# EAGLE design jnode_v31 (EAGLE 6.2)
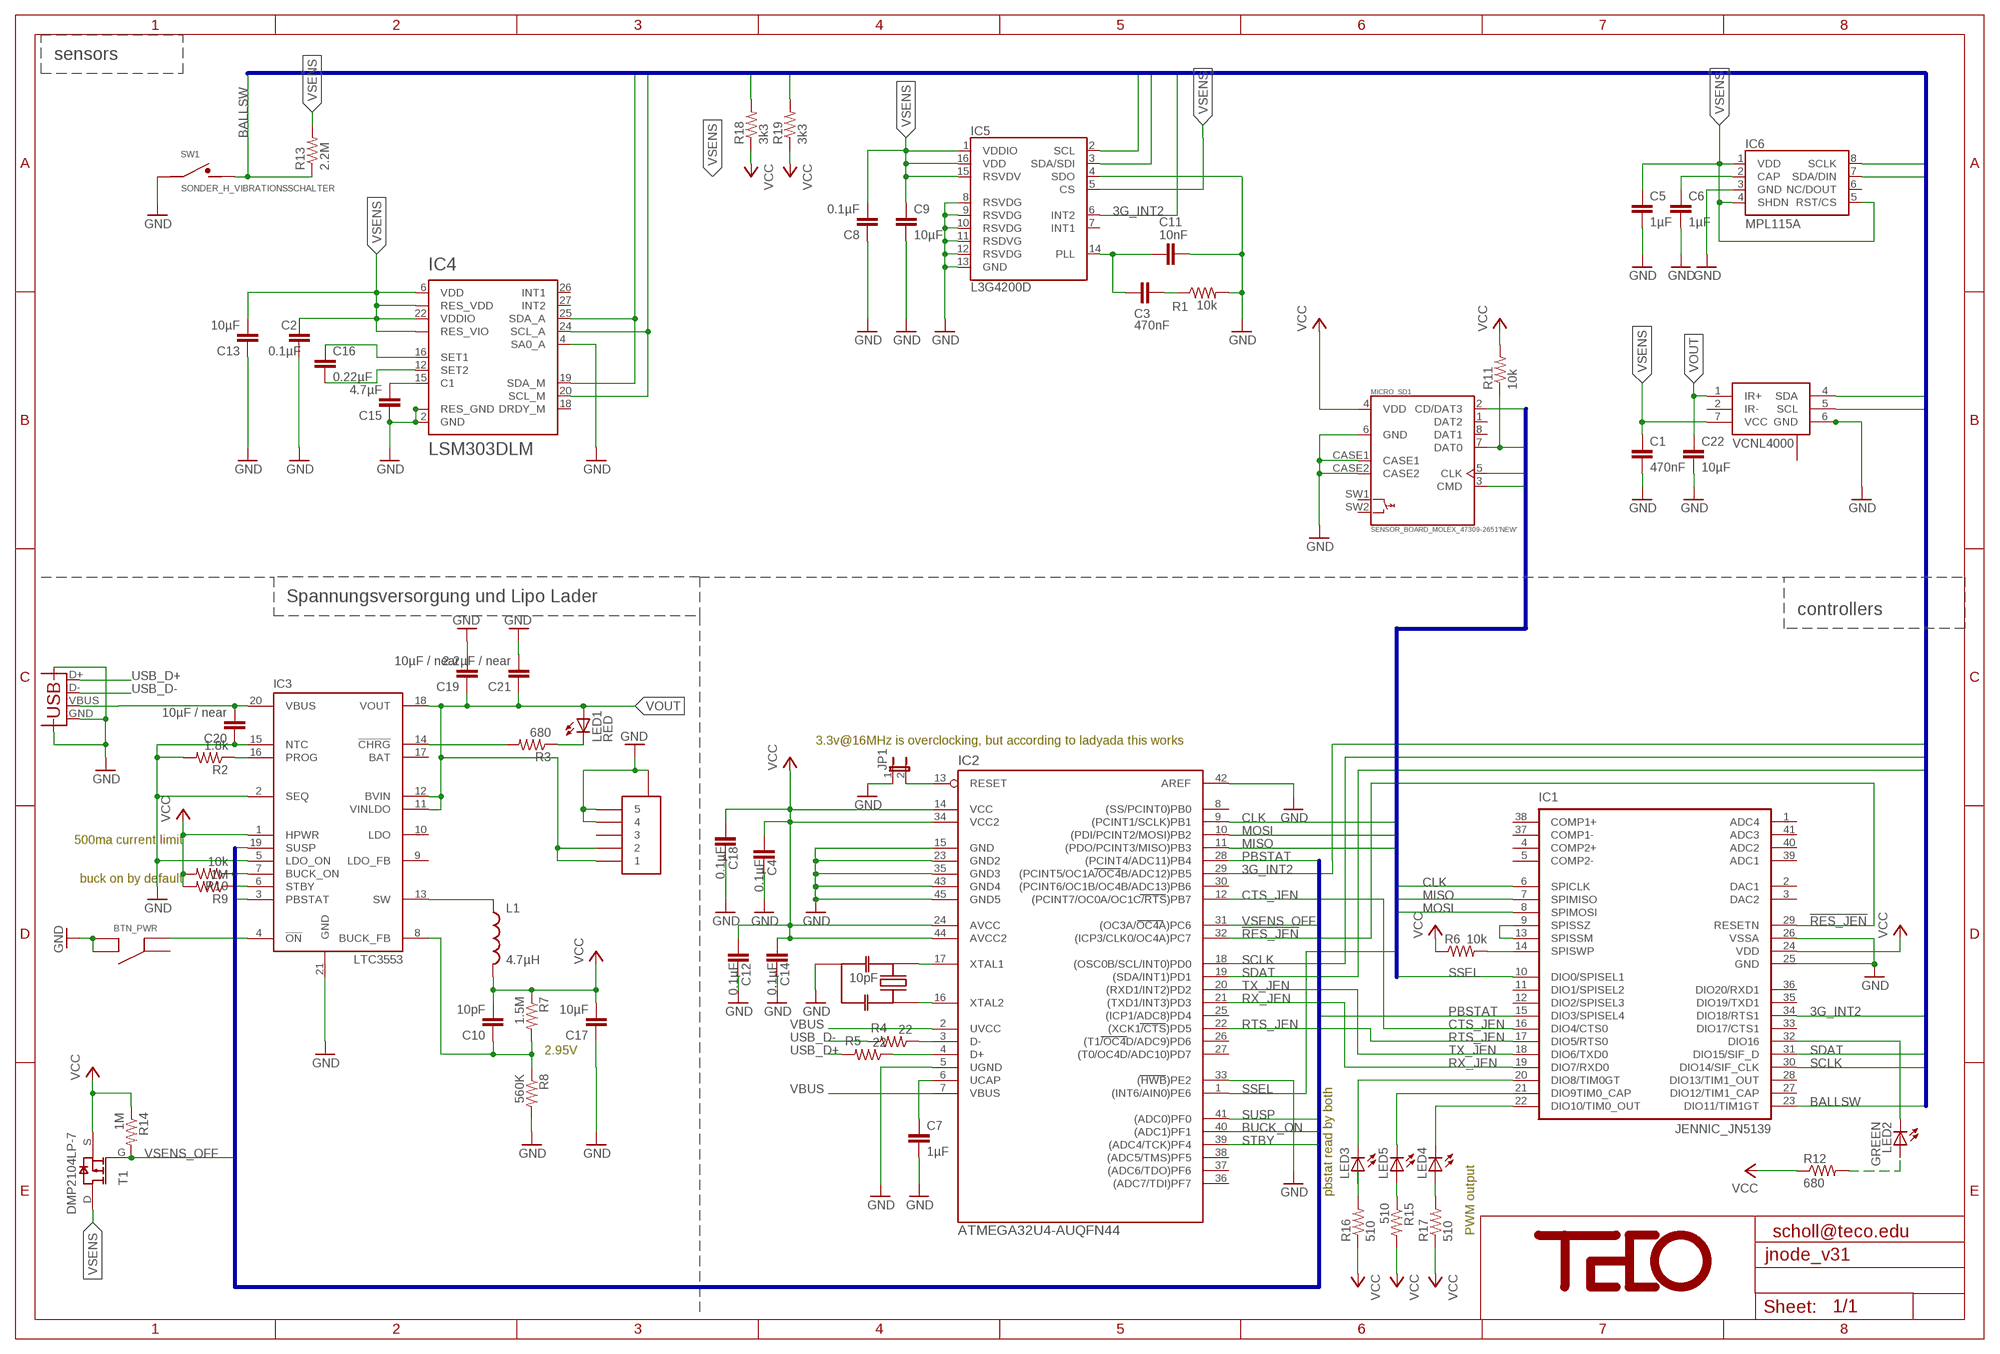
[diagram p0: schematic, sheet 1]

## Parts
BTN_PWR  TACTILE_SWITCH  [EVQ-PUK02K]
C1  470nF  CAP0402-CAP  [0402-CAP]
C2  0.1µF  CAP0402-CAP  [0402-CAP]
C3  470nF  CAP0402-CAP  [0402-CAP]
C4  0.1µF  CAP0402-CAP  [0402-CAP]
C5  1µF  CAP0402-CAP  [0402-CAP]
C6  1µF  CAP0402-CAP  [0402-CAP]
C7  1µF  CAP0402-CAP  [0402-CAP]
C8  0.1µF  CAP0402-CAP  [0402-CAP]
C9  10µF  CAP0603-CAP  [0603-CAP]
C10  10pF  CAP0402-CAP  [0402-CAP]
C11  10nF  CAP0402-CAP  [0402-CAP]
C12  0.1µF  CAP0402-CAP  [0402-CAP]
C13  10µF  CAP0603-CAP  [0603-CAP]
C14  0.1µF  CAP0402-CAP  [0402-CAP]
C15  4.7µF  CAP0402-CAP  [0402-CAP]
C16  0.22µF  CAP0402-CAP  [0402-CAP]
C17  10µF  CAP0603-CAP  [0603-CAP]
C18  0.1µF  CAP0402-CAP  [0402-CAP]
C19  10µF / near  CAP0603-CAP  [0603-CAP]
C20  10µF / near  CAP0603-CAP  [0603-CAP]
C21  2.2µF / near  CAP0402-CAP  [0402-CAP]
C22  10µF  CAP0603-CAP  [0603-CAP]
IC1  JENNIC_JN5139  JENNIC_JN51XXSMDTH  [JN5148_SMDTH]
IC2  ATMEGA32U4-AUQFN44  [QFN44]
IC3  LTC3553  [QFN20]
IC4  LSM303DLM  LSM303LGA28_LONG  [LGA28]
IC5  L3G4200D  [LGA16-4X4]
IC6  MPL115A  [LGA8]
JP1  JUMPER-2SMD-NO  [SJ_2S-NO]
L1  4.7µH  SPARKFUN_INDUCTOR  [MLP2012]
LED1  RED  LEDCHIP-LED0402  [CHIP-LED0402]
LED2  GREEN  LEDCHIP-LED0402  [CHIP-LED0402]
LED3  LEDGL100MD1MP1  [GL100MD1MP1]
LED4  LEDGL100MD1MP1  [GL100MD1MP1]
LED5  LEDGL100MD1MP1  [GL100MD1MP1]
MICRO_SD1  SENSOR_BOARD_MOLEX_47309-2651'NEW'  [SENSOR_BOARD_MOLEX_47309-2651]
R1  10k  RESISTOR0402-RES  [0402-RES]
R2  1.8k  RESISTOR0402-RES  [0402-RES]
R3  680  RESISTOR0402-RES  [0402-RES]
R4  22  RESISTOR0402-RES  [0402-RES]
R5  22  RESISTOR0402-RES  [0402-RES]
R6  10k  RESISTOR0402-RES  [0402-RES]
R7  1.5M  RESISTOR0402-RES  [0402-RES]
R8  560K  RESISTOR0402-RES  [0402-RES]
R9  1M  RESISTOR0402-RES  [0402-RES]
R10  10k  RESISTOR0402-RES  [0402-RES]
R11  10k  RESISTOR0402-RES  [0402-RES]
R12  680  RESISTOR0402-RES  [0402-RES]
R13  2.2M  RESISTOR  [0805]
R14  1M  RESISTOR0402-RES  [0402-RES]
R15  510  RESISTOR0402-RES  [0402-RES]
R16  510  RESISTOR0402-RES  [0402-RES]
R17  510  RESISTOR0402-RES  [0402-RES]
R18  3k3  RESISTOR0402-RES  [0402-RES]
R19  3k3  RESISTOR0402-RES  [0402-RES]
SW1  SONDER_H_VIBRATIONSSCHALTER  [SONDER_H_VIBSCHALTER]
T1  DMP2104LP-7  [DFN1411-3]
U$1  SFV5R  [SFV5R]
U$6  RESONATORPRQC-S  [PRQC]
U$9  TECO-LOGO  [TECO-LOGO]
VCNL4000  VCNL4000  [VNCL4000]
X1  USB-MICROB  [USB-MICROB]

## Nets
3G_INT2: IC1.34(DIO18/RTS1) IC2.29((PCINT5/OC1A/OC4B/ADC12)PB5) IC5.6(INT2)
!RES_JEN: IC1.29(RESETN) IC2.32((ICP3/CLK0/OC4A)PC7)
BALLSW: IC1.23(DIO11/TIM1GT) R13.1 SW1.2
BUCK_FB: C10.1 IC3.8(BUCK_FB) R7.2 R8.1
BUCK_ON: IC2.40((ADC1)PF1) IC3.7(BUCK_ON) R10.1
CLK: IC1.6(SPICLK) IC2.9((PCINT1/SCLK)PB1) MICRO_SD1.5(CLK)
CTS_JEN: IC1.16(DIO4/CTS0) IC2.12((PCINT7/OC0A/OC1C/RTS)PB7)
GND: BTN_PWR.2(B) BTN_PWR.4(B) C1.2 C2.2 C4.1 C5.2 C6.2 C7.2 C8.1 C9.2 C11.1 C12.1 C13.1 C14.1 C15.1 C17.1 C18.1 C19.2 C20.1 C21.2 C22.2 IC1.25(GND) IC1.26(VSSA) IC2.5(UGND) IC2.15(GND) IC2.23(GND2) IC2.33((HWB)PE2) IC2.35(GND3) IC2.42(AREF) IC2.43(GND4) IC2.45(GND5) IC3.2(SEQ) IC3.5(LDO_ON) IC3.15(NTC) IC3.21(GND) IC4.1(RES_GND) IC4.2(GND) IC4.3(RES_GND) IC4.4(SA0_A) IC4.17(RES_GND) IC4.28(RES_GND) IC5.4(SDO) IC5.8(RSVDG) IC5.9(RSVDG) IC5.10(RSVDG) IC5.11(RSDVG) IC5.12(RSVDG) IC5.13(GND) IC6.3(GND) JP1.1 MICRO_SD1.6(GND) MICRO_SD1.CASE1 MICRO_SD1.CASE2 R1.2 R2.2 R8.2 SW1.1 U$1.P$4 U$1.P$5 U$1.P$6 U$1.P$7 U$6.GND VCNL4000.6(GND) VCNL4000.12(GND) X1.GND X1.GND@2(CASE) X1.GND@3(CASE)
LEDRED: IC1.32(DIO16) LED2.P$2(C)
MISO: IC1.7(SPIMISO) IC2.11((PDO/PCINT3/MISO)PB3) MICRO_SD1.7(DAT0) R11.1
MOSI: IC1.8(SPIMOSI) IC2.10((PDI/PCINT2/MOSI)PB2) MICRO_SD1.3(CMD)
N$1: IC2.3(D-) R4.1
N$2: C16.1 IC4.16(SET1)
N$3: IC2.4(D+) R5.1
N$4: C7.1 IC2.6(UCAP)
N$5: IC3.16(PROG) R2.1
N$6: VCNL4000.2(IR-) VCNL4000.3(IR-)
N$8: C16.2 IC4.12(SET2)
N$9: BTN_PWR.3(A) IC3.4(!ON)
N$10: C6.1 IC6.2(CAP)
N$11: LED1.P$2(C) R3.1
N$12: IC3.14(!CHRG) R3.2
N$13: IC1.9(SPISSZ) IC1.13(SPISSM)
N$14: IC1.14(SPISWP) R6.2
N$16: IC2.17(XTAL1) U$6.2
N$17: IC2.16(XTAL2) U$6.1
N$25: C15.2 IC4.15(C1)
N$26: C3.1 C11.2 IC5.14(PLL)
N$27: C3.2 R1.1
N$29: LED2.P$1(A) R12.2
N$30: IC1.21(DIO9TIM0_CAP) LED5.2(C)
N$31: IC1.20(DIO8/TIM0GT) LED3.2(C)
N$32: LED3.1(A) R16.2
N$33: LED5.1(A) R15.1
N$34: IC1.22(DIO10/TIM0_OUT) LED4.2(C)
N$35: LED4.1(A) R17.2
PBSTAT: IC1.15(DIO3/SPISEL4) IC2.28((PCINT4/ADC11)PB4) IC3.3(PBSTAT)
RTS_JEN: IC1.17(DIO5/RTS0) IC2.22((XCK1/CTS)PD5)
RX_JEN: IC1.19(DIO7/RXD0) IC2.21((TXD1/INT3)PD3)
SCLK: IC1.30(DIO14/SIF_CLK) IC2.18((OSC0B/SCL/INT0)PD0) IC4.20(SCL_M) IC4.24(SCL_A) IC5.2(SCL) IC6.8(SCLK) R19.2 VCNL4000.5(SCL)
SDAT: IC1.31(DIO15/SIF_D) IC2.19((SDA/INT1)PD1) IC4.19(SDA_M) IC4.25(SDA_A) IC5.3(SDA/SDI) IC6.7(SDA/DIN) R18.2 VCNL4000.4(SDA)
SHWO: IC2.13(RESET) JP1.2
SSEL: IC1.10(DIO0/SPISEL1) IC2.1((INT6/AIN0)PE6) MICRO_SD1.2(CD/DAT3)
STBY: IC2.39((ADC4/TCK)PF4) IC3.6(STBY) R9.1
SUSP: IC2.41((ADC0)PF0) IC3.19(SUSP)
SW: IC3.13(SW) L1.P$1
TX_JEN: IC1.18(DIO6/TXD0) IC2.20((RXD1/INT2)PD2)
USB_D+: R5.2 X1.D+
USB_D-: R4.2 X1.D-
VBUS: C20.2 IC2.2(UVCC) IC2.7(VBUS) IC3.20(VBUS) X1.VBUS
VCC: C4.2 C10.2 C12.2 C14.2 C17.2 C18.2 IC1.24(VDD) IC2.14(VCC) IC2.24(AVCC) IC2.34(VCC2) IC2.44(AVCC2) IC3.1(HPWR) L1.P$2 MICRO_SD1.4(VDD) R6.1 R7.1 R9.2 R10.2 R11.2 R12.1 R14.1 R15.2 R16.1 R17.1 R18.1 R19.1 T1.S
VOUT: C19.1 C21.1 C22.1 IC3.11(VINLDO) IC3.12(BVIN) IC3.18(VOUT) LED1.P$1(A) U$1.P$1 U$1.P$2 VCNL4000.1(IR+)
VSENS: C1.1 C2.1 C5.1 C8.2 C9.1 C13.2 IC4.6(VDD) IC4.7(RES_VDD) IC4.22(VDDIO) IC4.23(RES_VIO) IC5.1(VDDIO) IC5.5(CS) IC5.15(RSVDV) IC5.16(VDD) IC6.1(VDD) IC6.4(SHDN) IC6.5(RST/CS) R13.2 T1.D VCNL4000.7(VCC)
VSENS_OFF: IC2.31((OC3A/OC4A)PC6) R14.2 T1.G
Unconnected: BTN_PWR.1(A) IC1.1(ADC4) IC1.2(DAC1) IC1.3(DAC2) IC1.4(COMP2+) IC1.5(COMP2-) IC1.11(DIO1/SPISEL2) IC1.12(DIO2/SPISEL3) IC1.27(DIO12/TIM1_CAP) IC1.28(DIO13/TIM1_OUT) IC1.33(DIO17/CTS1) IC1.35(DIO19/TXD1) IC1.36(DIO20/RXD1) IC1.37(COMP1-) IC1.38(COMP1+) IC1.39(ADC1) IC1.40(ADC2) IC1.41(ADC3) IC2.8((SS/PCINT0)PB0) IC2.25((ICP1/ADC8)PD4) IC2.26((T1/OC4D/ADC9)PD6) IC2.27((T0/OC4D/ADC10)PD7) IC2.30((PCINT6/OC1B/OC4B/ADC13)PB6) IC2.36((ADC7/TDI)PF7) IC2.37((ADC6/TDO)PF6) IC2.38((ADC5/TMS)PF5) IC3.9(LDO_FB) IC3.10(LDO) IC3.17(BAT) IC4.18(DRDY_M) IC4.26(INT1) IC4.27(INT2) IC5.7(INT1) IC6.6(NC/DOUT) MICRO_SD1.1(DAT2) MICRO_SD1.8(DAT1) MICRO_SD1.SW1 MICRO_SD1.SW2 U$1.P$3 VCNL4000.8(NC) VCNL4000.9(NC) VCNL4000.10(NC) VCNL4000.11(NC)

## Buses
PWRCTRL:BUCK_ON,STBY,PBSTAT,SUSP,VSENS_OFF
SPI:SSEL,MISO,MOSI,CLK
I2C:SCLK,SDAT,BALLSW,INT1

## Notes on the sheet
- sensors
- Spannungsversorgung und Lipo Lader
- controllers
- 3.3v@16MHz is overclocking, but according to ladyada this works
- 500ma current limit
- buck on by default
- 10pF
- 2.95V
- pbstat read by both
- PWM output | scholl@teco.edu

## Library data of the parts
BTN_PWR = jnode:TACTILE_SWITCH: collection of tactile switches; DIGIKEY: http://search.digikey.com/scripts/DkSearch/dksus.dll?Detail&name=P10852SCT-ND
C1 C3 = sparkfun:CAP: Capacitor Standard 0603 ceramic capacitor, and 0.1" leaded capacitor.; DIGIKEY: http://search.digikey.com/scripts/DkSearch/dksus.dll?Detail&name=311-1334-1-ND; FARNELL: http://de.farnell.com/multicomp/mcca000510/mlcc-0402-x5r-16v-0-047uf/dp/1759386; TECO: yes
C2 = sparkfun:CAP: Capacitor Standard 0603 ceramic capacitor, and 0.1" leaded capacitor.; DIGIKEY: http://search.digikey.com/scripts/DkSearch/dksus.dll?Detail&name=445-7396-1-ND; FARNELL: http://de.farnell.com/multicomp/mcca000051/mlcc-04025v-16v-100nf/dp/1758897; TECO: yes
C4 C18 = sparkfun:CAP: Capacitor Standard 0603 ceramic capacitor, and 0.1" leaded capacitor.; DIGIKEY: http://search.digikey.com/scripts/DkSearch/dksus.dll?Detail&name=490-1318-1-ND; FARNELL: http://de.farnell.com/multicomp/mcca000051/mlcc-04025v-16v-100nf/dp/1758897; PLACE: no; TECO: yes
C5-C7 = sparkfun:CAP: Capacitor Standard 0603 ceramic capacitor, and 0.1" leaded capacitor.; DIGIKEY: http://search.digikey.com/scripts/DkSearch/dksus.dll?Detail&name=490-1320-1-ND; FARNELL: http://de.farnell.com/multicomp/mcca000500/mlcc-0402-x5r-6-3v-1uf/dp/1759375; TECO: yes
C8 C12 C14 = sparkfun:CAP: Capacitor Standard 0603 ceramic capacitor, and 0.1" leaded capacitor.; DIGIKEY: http://search.digikey.com/scripts/DkSearch/dksus.dll?Detail&name=490-1318-1-ND; FARNELL: http://de.farnell.com/multicomp/mcca000051/mlcc-04025v-16v-100nf/dp/1758897; TECO: yes
C9 C19 C20 = sparkfun:CAP: Capacitor Standard 0603 ceramic capacitor, and 0.1" leaded capacitor.; DIGIKEY: http://search.digikey.com/scripts/DkSearch/dksus.dll?Detail&name=445-7454-1-ND; FARNELL: http://de.farnell.com/multicomp/mcca000517/mlcc-0603-x5r-6-3v-10uf/dp/1759393; TECO: yes
C10 = sparkfun:CAP: Capacitor Standard 0603 ceramic capacitor, and 0.1" leaded capacitor.; DIGIKEY: http://search.digikey.com/scripts/DkSearch/dksus.dll?Detail&name=311-1014-1-ND; FARNELL: http://de.farnell.com/multicomp/mcca000091/mlcc-0402-np0-50v-10pf/dp/1758941; TECO: yes
C11 = sparkfun:CAP: Capacitor Standard 0603 ceramic capacitor, and 0.1" leaded capacitor.; DIGIKEY: http://search.digikey.com/scripts/DkSearch/dksus.dll?Detail&name=478-1114-1-ND; FARNELL: http://de.farnell.com/multicomp/mcca000076/mlcc-0402-x7r-25v-10nf/dp/1758924; TECO: yes
C13 = sparkfun:CAP: Capacitor Standard 0603 ceramic capacitor, and 0.1" leaded capacitor.; FARNELL: http://de.farnell.com/multicomp/mcca000517/mlcc-0603-x5r-6-3v-10uf/dp/1759393; TECO: yes
C15 = sparkfun:CAP: Capacitor Standard 0603 ceramic capacitor, and 0.1" leaded capacitor.; DIGIKEY: http://search.digikey.com/scripts/DkSearch/dksus.dll?Detail&name=490-5408-1-ND; FARNELL: http://de.farnell.com/avx/04024d475mat2a/kondensator-0402-x5r-4v-4-7uf/dp/1833801; TECO: yes
C16 = sparkfun:CAP: Capacitor Standard 0603 ceramic capacitor, and 0.1" leaded capacitor.; DIGIKEY: http://search.digikey.com/scripts/DkSearch/dksus.dll?Detail&name=311-1350-1-ND; FARNELL: http://de.farnell.com/multicomp/mcca000036/mlcc-04025v-10v-220nf/dp/1758880; TECO: yes
C17 C22 = sparkfun:CAP: Capacitor Standard 0603 ceramic capacitor, and 0.1" leaded capacitor.; DIGIKEY: http://search.digikey.com/scripts/DkSearch/dksus.dll?Detail&name=311-1014-1-ND; FARNELL: http://de.farnell.com/multicomp/mcca000517/mlcc-0603-x5r-6-3v-10uf/dp/1759393; TECO: yes
C21 = sparkfun:CAP: Capacitor Standard 0603 ceramic capacitor, and 0.1" leaded capacitor.; DIGIKEY: http://search.digikey.com/scripts/DkSearch/dksus.dll?Detail&name=445-7396-1-ND; FARNELL: http://de.farnell.com/multicomp/mcca000501/mlcc-0402-x5r-6-3v-2-2uf/dp/1759376RL; TECO: yes
IC1 = jnode:JENNIC_JN51XX: JN5139-xxx-M00xxx, Farnell: 1500175; DIGIKEY: http://search.digikey.com/de/de/products/JN5148%2F001M00T,534/616-1045-1-ND/2139684; FUTUREELECTRIC: http://de.futureelectronics.com/de/technologies/semiconductors/microcontrollers/32-bit/Seiten/6004977-JN5148-001M00T,534.aspx; TECO: yes
IC2 = jnode:ATMEGA32U4-AU; DIGIKEY: http://search.digikey.com/scripts/DkSearch/dksus.dll?Detail&name=ATMEGA32U4-MU-ND
IC3 = jnode:LTC3553; DIGIKEY: http://search.digikey.com/scripts/DkSearch/dksus.dll?Detail&name=LTC3553EUD%23PBF-ND
IC4 = jnode:LSM303: LSM303DLH ? 3-axis accelerometer and 3-axis magnetometer ? Digital supply voltage IOs: 1.8 V ? Power-down mode ? ±1.3 to ±8,1 gauss magnetic field full-scale ? ±2 g/±4 g/±8 g dynamically selectable fullscale ? 16-bit data out ? I2C serial interface http://www.st.com/stonline/products/literature/ds/16941/lsm303dlh.pdf; DIGIKEY: http://search.digikey.com/scripts/DkSearch/dksus.dll?Detail&name=497-11240-1-ND; FUTUREELECTRIC: http://de.futureelectronics.com/de/technologies/semiconductors/analog/sensors/accelerometers/Seiten/8010012-LSM303DLMTR.aspx
IC5 = sparkfun:L3G4200D: L3G4200D Three-axis, digital output gyroscope The L3G4200D is a low-power three-axis angular rate sensor, has a full scale of ±250/±500/±2000 dps and is capable of measuring rates with a user-selectable bandwidth. It includes a sensing element and an IC interface capable of providing the measured angular rate to the external world through a digital interface (I2C/SPI). Package: 4x4x1.1 LGA-16 (LGA16-4x4.PAC); DIGIKEY: http://search.digikey.com/scripts/DkSearch/dksus.dll?Detail&name=497-11071-1-ND; FARNELL: http://de.farnell.com/stmicroelectronics/l3g4200d/gyro-mems-3achsen-16llga-16lga/dp/1872924?Ntt=l3g4200; FUTUREELECTRIC: http://de.futureelectronics.com/de/technologies/semiconductors/analog/sensors/motion/Seiten/2007852-L3G4200DTR.aspx
IC6 = mpl115:MPL115A: MPL115A1 (SPI) and MPL115A2 (I2C) Miniature Digital Barometer 5.0x3.0x1.2mm LGA Package; DIGIKEY: http://search.digikey.com/scripts/DkSearch/dksus.dll?Detail&name=MPL115A2T1CT-ND; TECO: yes
JP1 = sparkfun:JUMPER-2: Jumper Basic 0.1" spaced jumper. Use with breakaway headers.
L1 = jnode:SPARKFUN_INDUCTOR: Inductors Basic Inductor/Choke - 0603 and 1206. Footprints are not proven and vary greatly between part numbers.; DIGIKEY: http://search.digikey.com/scripts/DkSearch/dksus.dll?Detail&name=445-6366-1-ND
LED1 LED2 = jnode:LED: LED OSRAM: - CHIPLED LG R971, LG N971, LY N971, LG Q971, LY Q971, LO R971, LY R971 LH N974, LH R974 LS Q976, LO Q976, LY Q976 LO Q996 - Hyper CHIPLED LW Q18S LB Q993, LB Q99A, LB R99A - SideLED LS A670, LO A670, LY A670, LG A670, LP A670 LB A673, LV A673, LT A673, LW A673 LH A674 LY A675 LS A676, LA A676, LO A676, LY A676, LW A676 LS A679, LY A679, LG A679 - Hyper Micro SIDELED® LS Y876, LA Y876, LO Y876, LY Y876 LT Y87S - SmartLED LW L88C, LW L88S LB L89C, LB L89S, LG L890 LS L89K, LO L89K, LY L89K LS L896, LA L896, LO L896, LY L896 - TOPLED LS T670, LO T670, LY T670, LG T670, LP T670 LSG T670, LSP T670, LSY T670, LOP T670, LYG T670 LG T671, LOG T671, LSG T671 LB T673, LV T673, LT T673, LW T673 LH T674 LS T676, LA T676, LO T676, LY T676, LB T676, LH T676, LSB T676, LW T676 LB T67C, LV T67C, LT T67C, LS T67K, LO T67K, LY T67K, LW E67C LS E67B, LA E67B, LO E67B, LY E67B, LB E67C, LV E67C, LT E67C LW T67C LS T679, LY T679, LG T679 LS T770, LO T770, LY T770, LG T770, LP T770 LB T773, LV T773, LT T773, LW T773 LH T774 LS E675, LA E675, LY E675, LS T675 LS T776, LA T776, LO T776, LY T776, LB T776 LHGB T686 LT T68C, LB T68C - Hyper Mini TOPLED® LB M676 - Mini TOPLED Santana® LG M470 LS M47K, LO M47K, LY M47K Source: http://www.osram.convergy.de LUXEON: - LUMILED® LXK2-PW12-R00, LXK2-PW12-S00, LXK2-PW14-U00, LXK2-PW14-V00 LXK2-PM12-R00, LXK2-PM12-S00, LXK2-PM14-U00 LXK2-PE12-Q00, LXK2-PE12-R00, LXK2-PE12-S00, LXK2-PE14-T00, LXK2-PE14-U00 LXK2-PB12-K00, LXK2-PB12-L00, LXK2-PB12-M00, LXK2-PB14-N00, LXK2-PB14-P00, LXK2-PB14-Q00 LXK2-PR12-L00, LXK2-PR12-M00, LXK2-PR14-Q00, LXK2-PR14-R00 LXK2-PD12-Q00, LXK2-PD12-R00, LXK2-PD12-S00 LXK2-PH12-R00, LXK2-PH12-S00 LXK2-PL12-P00, LXK2-PL12-Q00, LXK2-PL12-R00 Source: www.luxeon.com KINGBRIGHT: KA-3528ASYC Source: www.kingbright.com; DIGIKEY: http://search.digikey.com/scripts/DkSearch/dksus.dll?Detail&name=754-1128-1-ND; TECO: yes
LED3-LED5 = jnode:LED: LED OSRAM: - CHIPLED LG R971, LG N971, LY N971, LG Q971, LY Q971, LO R971, LY R971 LH N974, LH R974 LS Q976, LO Q976, LY Q976 LO Q996 - Hyper CHIPLED LW Q18S LB Q993, LB Q99A, LB R99A - SideLED LS A670, LO A670, LY A670, LG A670, LP A670 LB A673, LV A673, LT A673, LW A673 LH A674 LY A675 LS A676, LA A676, LO A676, LY A676, LW A676 LS A679, LY A679, LG A679 - Hyper Micro SIDELED® LS Y876, LA Y876, LO Y876, LY Y876 LT Y87S - SmartLED LW L88C, LW L88S LB L89C, LB L89S, LG L890 LS L89K, LO L89K, LY L89K LS L896, LA L896, LO L896, LY L896 - TOPLED LS T670, LO T670, LY T670, LG T670, LP T670 LSG T670, LSP T670, LSY T670, LOP T670, LYG T670 LG T671, LOG T671, LSG T671 LB T673, LV T673, LT T673, LW T673 LH T674 LS T676, LA T676, LO T676, LY T676, LB T676, LH T676, LSB T676, LW T676 LB T67C, LV T67C, LT T67C, LS T67K, LO T67K, LY T67K, LW E67C LS E67B, LA E67B, LO E67B, LY E67B, LB E67C, LV E67C, LT E67C LW T67C LS T679, LY T679, LG T679 LS T770, LO T770, LY T770, LG T770, LP T770 LB T773, LV T773, LT T773, LW T773 LH T774 LS E675, LA E675, LY E675, LS T675 LS T776, LA T776, LO T776, LY T776, LB T776 LHGB T686 LT T68C, LB T68C - Hyper Mini TOPLED® LB M676 - Mini TOPLED Santana® LG M470 LS M47K, LO M47K, LY M47K Source: http://www.osram.convergy.de LUXEON: - LUMILED® LXK2-PW12-R00, LXK2-PW12-S00, LXK2-PW14-U00, LXK2-PW14-V00 LXK2-PM12-R00, LXK2-PM12-S00, LXK2-PM14-U00 LXK2-PE12-Q00, LXK2-PE12-R00, LXK2-PE12-S00, LXK2-PE14-T00, LXK2-PE14-U00 LXK2-PB12-K00, LXK2-PB12-L00, LXK2-PB12-M00, LXK2-PB14-N00, LXK2-PB14-P00, LXK2-PB14-Q00 LXK2-PR12-L00, LXK2-PR12-M00, LXK2-PR14-Q00, LXK2-PR14-R00 LXK2-PD12-Q00, LXK2-PD12-R00, LXK2-PD12-S00 LXK2-PH12-R00, LXK2-PH12-S00 LXK2-PL12-P00, LXK2-PL12-Q00, LXK2-PL12-R00 Source: www.luxeon.com KINGBRIGHT: KA-3528ASYC Source: www.kingbright.com; FARNELL: http://de.farnell.com/sharp/gl100md1mp1/ir-emitter-smd-940nm/dp/9707816?Ntt=970-7816; PLACE: no
MICRO_SD1 = teco_div:SENSOR_BOARD_MOLEX_47309-2651; DIGIKEY: http://search.digikey.com/scripts/DkSearch/dksus.dll?Detail&name=WM3974CT-ND; TECO: yes
R1 R6 R9-R11 R14 = sparkfun:RESISTOR: Resistor Basic schematic elements and footprints for 0603, 1206, and PTH 1/10th watt (small) resistors.; DIGIKEY: http://search.digikey.com/scripts/DkSearch/dksus.dll?Detail&name=311-10KJRCT-ND; FARNELL: http://de.farnell.com/bourns/cr0603-jw-103elf/widerstand-0603-10k-5-0-1w/dp/2008360; TECO: yes
R2 = sparkfun:RESISTOR: Resistor Basic schematic elements and footprints for 0603, 1206, and PTH 1/10th watt (small) resistors.; DIGIKEY: http://search.digikey.com/scripts/DkSearch/dksus.dll?Detail&name=311-1.8KJRCT-ND; FARNELL: http://de.farnell.com/vishay-draloric/crcw04021k80fkeahp/widerstand-0402-1-1k80/dp/1738853; TECO: yes
R3 = sparkfun:RESISTOR: Resistor Basic schematic elements and footprints for 0603, 1206, and PTH 1/10th watt (small) resistors.; DIGIKEY: http://search.digikey.com/scripts/DkSearch/dksus.dll?Detail&name=311-39JRCT-ND
R4 R5 = sparkfun:RESISTOR: Resistor Basic schematic elements and footprints for 0603, 1206, and PTH 1/10th watt (small) resistors.; DIGIKEY: http://search.digikey.com/scripts/DkSearch/dksus.dll?Detail&name=311-22JRCT-ND; FARNELL: http://de.farnell.com/multicomp/mc-0-0625w-0402-1-22r/widerstand-0402-1-22r/dp/1357998
R7 = sparkfun:RESISTOR: Resistor Basic schematic elements and footprints for 0603, 1206, and PTH 1/10th watt (small) resistors.; DIGIKEY: http://search.digikey.com/scripts/DkSearch/dksus.dll?Detail&name=541-2.20MLCT-ND; FARNELL: http://de.farnell.com/yageo-phycomp/rc0402fr-071m8l/widerstand-0402-0-063w-1-1m8/dp/1458753; TECO: yes
R8 = sparkfun:RESISTOR: Resistor Basic schematic elements and footprints for 0603, 1206, and PTH 1/10th watt (small) resistors.; DIGIKEY: http://search.digikey.com/scripts/DkSearch/dksus.dll?Detail&name=RMCF0402FT698KCT-ND; FARNELL: http://de.farnell.com/yageo-phycomp/rc0402jr-07560kl/widerstand-rc31-0402-560k/dp/9233091
R12 = sparkfun:RESISTOR: Resistor Basic schematic elements and footprints for 0603, 1206, and PTH 1/10th watt (small) resistors.
R13 = sparkfun:RESISTOR: Resistor Basic schematic elements and footprints for 0603, 1206, and PTH 1/10th watt (small) resistors.; DIGIKEY: http://search.digikey.com/scripts/DkSearch/dksus.dll?Detail&name=541-2.20MLCT-ND; FARNELL: http://de.farnell.com/te-connectivity-cgs/rh73u2a2m2jtd/widerstand-0805-2m2/dp/1174056
R15-R17 = sparkfun:RESISTOR: Resistor Basic schematic elements and footprints for 0603, 1206, and PTH 1/10th watt (small) resistors.; PLACE: no
R18 R19 = sparkfun:RESISTOR: Resistor Basic schematic elements and footprints for 0603, 1206, and PTH 1/10th watt (small) resistors.; DIGIKEY: http://search.digikey.com/scripts/DkSearch/dksus.dll?Detail&name=541-2.20MLCT-ND; FARNELL: http://de.farnell.com/bourns/cr0603-jw-103elf/widerstand-0603-10k-5-0-1w/dp/2008360; PLACE: no; TECO: yes
SW1 = jnode:SONDER_H_VIBRATIONSSCHALTER: Vibrationsschalter von FZK oder Signalquest SignalQuest, Inc. 1 Mechanic St. Lebanon, NH 03766 USA www.signalquest.com
T1 = jnode:DMP2104LP
U$1 = jnode:SFV5R; DIGIKEY: http://www.digikey.de/product-detail/de/SFV5R-1STE1HLF/609-4330-1-ND/2626781; KONTAKTE: unten
U$6 = jnode:RESONATOR: Ceramic Resonator with caps AWSCR-16.00CV-T: 16Mhz ceramic resonator with 22pF capacitors PRQC16.00SR5010X000: 16Mhz ceramic resonator with 10pF capacitors; DIGIKEY: http://search.digikey.com/scripts/DkSearch/dksus.dll?Detail&name=478-5420-1-ND
U$9 = teco_div:TECO-LOGO
VCNL4000 = VCNL4000:VCNL4000; DIGIKEY: http://search.digikey.com/scripts/DkSearch/dksus.dll?Detail&name=751-1505-1-ND; TECO: yes
X1 = sparkfun:USB: USB Connectors USB-B-PTH is fully proven SKU : PRT-00139 USB-miniB is fully proven SKU : PRT-00587 USB-A-PCB is untested. USB-A-H is throughly reviewed, but untested. Spark Fun Electronics SKU : PRT-00437 USB-B-SMT is throughly reviewed, but untested. Needs silkscreen touching up. USB-A-S has not been used/tested USB-MB-H has not been used/tested; DIGIKEY: http://search.digikey.com/scripts/DkSearch/dksus.dll?Detail&name=H11635CT-ND

## Board
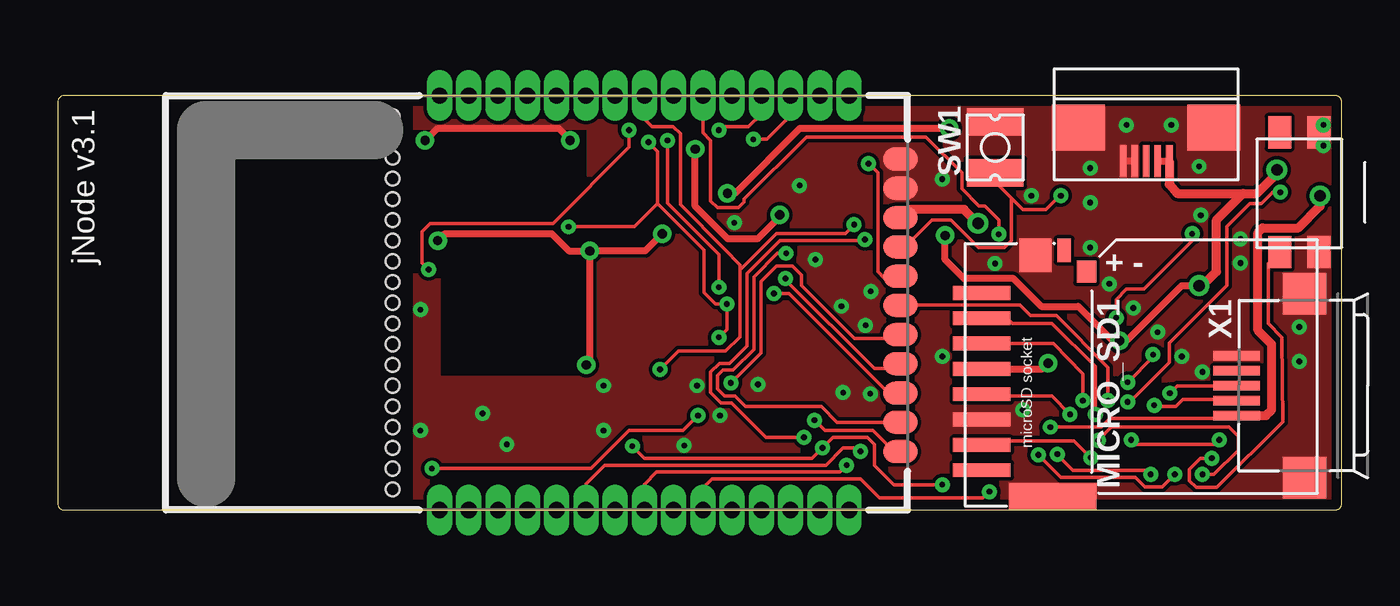
[diagram p1: board, top side]
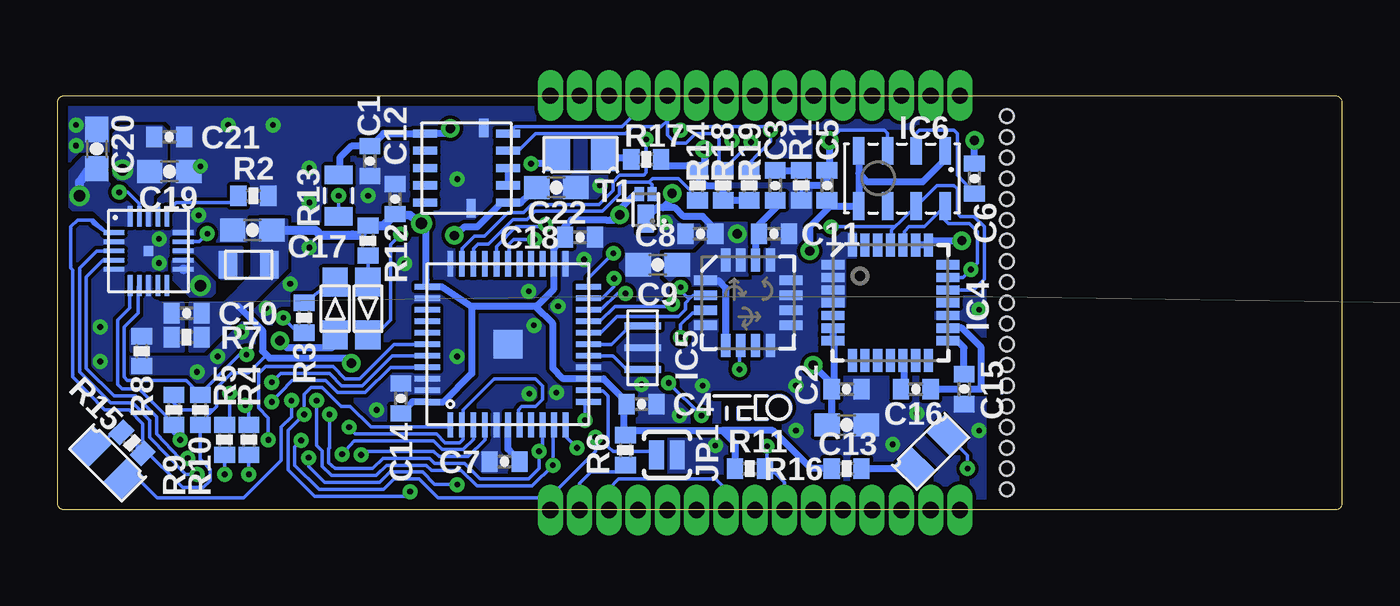
[diagram p2: board, bottom side, seen from below]

Size 55.75 x 18 mm. Coordinates in mm from the lower left corner, seen from the top.
Outline: 0.3,18 arc88 0,17.7 0,0.3 arc92 0.3,0 55.45,0 arc90 55.75,0.3 55.75,17.7 arc90 55.45,18 0.3,18
Copper layers (1*16): Top 0.018mm / dielectric 1.55mm / Bottom 0.018mm
Design rules: minimum track width 0.15mm, minimum drill 0.25mm, track to track 0.15mm, track to pad 0.15mm, pad to pad 0.15mm, via to via 0.15mm, smd to smd 0.15mm, copper to edge 0.45mm, drill to drill 0.3mm, minimum pad ring 0.2mm, minimum via ring 0.2mm, stop-mask expansion 0.1mm, vias tented up to drill 0.25mm, thermal gap 0.2mm
Holes 0.6 mm at 14.55,17.1 14.55,16.2 14.55,15.3 14.55,14.4 14.55,13.5 14.55,12.6 14.55,11.7 14.55,10.8 14.55,9.9 14.55,9 14.55,8.1 14.55,7.2 14.55,6.3 14.55,5.4 14.55,4.5 14.55,3.6 14.55,2.7 14.55,1.8 14.55,0.9
tRestrict: area 15.4,12.4 to 22.9,16.5; area 16.6,5.8 to 22.5,11.7
bRestrict: area 15.4,12.4 to 22.9,16.5

### Footprints (pad centres in the part's own frame; a part is rotated, then mirrored left to right if it is on the bottom)
EVQ-PUK02K = smd 1.4 x 1: 1 5,2.5; 2 5,0.8; 3 -0.2,2.5; 4 -0.2,0.8
0402-CAP = smd 0.7 x 0.9: 1 -0.65,0; 2 0.65,0
0603-CAP = smd 1.1 x 1: 1 -0.85,0; 2 0.85,0
JN5148_SMDTH = drill 0.7 pad 1.016 long: 1 -8.9,9.32; 2 -8.9,8.05; 3 -8.9,6.78; 4 -8.9,5.51; 5 -8.9,4.24; 6 -8.9,2.97; 7 -8.9,1.7; 8 -8.9,0.43; 9 -8.9,-0.84; 10 -8.9,-2.11; 11 -8.9,-3.38; 12 -8.9,-4.65; 13 -8.9,-5.92; 14 -8.9,-7.19; 15 -8.9,-8.46; 27 9.1,-8.46; 28 9.1,-7.19; 29 9.1,-5.92; 30 9.1,-4.65; 31 9.1,-3.38; 32 9.1,-2.11; 33 9.1,-0.84; 34 9.1,0.43; 35 9.1,1.7; 36 9.1,2.97; 37 9.1,4.24; 38 9.1,5.51; 39 9.1,6.78; 40 9.1,8.05; 41 9.1,9.32 | smd 1 x 1.5: 16 -6.36,-10.69; 17 -5.09,-10.69; 18 -3.82,-10.69; 19 -2.55,-10.69; 20 -1.28,-10.69; 21 -0.01,-10.69; 22 1.26,-10.69; 23 2.53,-10.69; 24 3.8,-10.69; 25 5.07,-10.69; 26 6.34,-10.69
QFN44 = smd 1.1 x 0.25: 1 -3.5,2.5; 2 -3.5,2; 3 -3.5,1.5; 4 -3.5,1; 5 -3.5,0.5; 6 -3.5,0; 7 -3.5,-0.5; 8 -3.5,-1; 9 -3.5,-1.5; 10 -3.5,-2; 11 -3.5,-2.5; 23 3.5,-2.5; 24 3.5,-2; 25 3.5,-1.5; 26 3.5,-1; 27 3.5,-0.5; 28 3.5,0; 29 3.5,0.5; 30 3.5,1; 31 3.5,1.5; 32 3.5,2; 33 3.5,2.5 | smd 0.25 x 1.1: 12 -2.5,-3.5; 13 -2,-3.5; 14 -1.5,-3.5; 15 -1,-3.5; 16 -0.5,-3.5; 17 0,-3.5; 18 0.5,-3.5; 19 1,-3.5; 20 1.5,-3.5; 21 2,-3.5; 22 2.5,-3.5; 34 2.5,3.5; 35 2,3.5; 36 1.5,3.5; 37 1,3.5; 38 0.5,3.5; 39 0,3.5; 40 -0.5,3.5; 41 -1,3.5; 42 -1.5,3.5; 43 -2,3.5; 44 -2.5,3.5 | smd 1.25 x 1.25: 45 0,0
QFN20 = smd 0.9 x 0.2: 1 -1.5,0.8; 2 -1.5,0.4; 3 -1.5,0; 4 -1.5,-0.4; 5 -1.5,-0.8; 11 1.5,-0.8; 12 1.5,-0.4; 13 1.5,0; 14 1.5,0.4; 15 1.5,0.8 | smd 0.2 x 0.9: 6 -0.8,-1.5; 7 -0.4,-1.5; 8 0,-1.5; 9 0.4,-1.5; 10 0.8,-1.5; 16 0.8,1.5; 17 0.4,1.5; 18 0,1.5; 19 -0.4,1.5; 20 -0.8,1.5 | smd 0.42 x 0.42: 21 0,0
LGA28 = smd 1 x 0.4: 1 -2.5,1.65; 2 -2.5,1.1; 3 -2.5,0.55; 4 -2.5,0; 5 -2.5,-0.55; 6 -2.5,-1.1; 7 -2.5,-1.65; 15 2.5,-1.65; 16 2.5,-1.1; 17 2.5,-0.55; 18 2.5,0; 19 2.5,0.55; 20 2.5,1.1; 21 2.5,1.65 | smd 0.4 x 1: 8 -1.65,-2.5; 9 -1.1,-2.5; 10 -0.55,-2.5; 11 0,-2.5; 12 0.55,-2.5; 13 1.1,-2.5; 14 1.65,-2.5; 22 1.65,2.5; 23 1.1,2.5; 24 0.55,2.5; 25 0,2.5; 26 -0.55,2.5; 27 -1.1,2.5; 28 -1.65,2.5
LGA16-4X4 = smd 1 x 0.4: 1 -1.85,0.975; 2 -1.85,0.325; 3 -1.85,-0.325; 4 -1.85,-0.975; 9 1.85,-0.975; 10 1.85,-0.325; 11 1.85,0.325; 12 1.85,0.975 | smd 0.4 x 1: 5 -0.975,-1.85; 6 -0.325,-1.85; 7 0.325,-1.85; 8 0.975,-1.85; 13 0.975,1.85; 14 0.325,1.85; 15 -0.325,1.85; 16 -0.975,1.85
LGA8 = smd 1.2 x 0.5: 1 -1.2,1.875; 2 -1.2,0.625; 3 -1.2,-0.625; 4 -1.2,-1.875; 5 1.2,-1.875; 6 1.2,-0.625; 7 1.2,0.625; 8 1.2,1.875
SJ_2S-NO = smd 0.635 x 1.27: 1 -0.45,0; 2 0.45,0
MLP2012 = smd 0.8 x 1.2: P$1 0.9,0; P$2 -0.9,0
CHIP-LED0402 = smd 1.25 x 1.1: P$1 -0.15,0; P$2 2.15,0
GL100MD1MP1 = smd 1.1 x 1.4: 1 -1,0; 2 1,0
SENSOR_BOARD_MOLEX_47309-2651 = smd 0.6 x 2.5: 1 3.43,2.385; 2 2.33,2.385; 3 1.23,2.385; 4 0.13,2.385; 5 -0.97,2.385; 6 -2.07,2.385; 7 -3.17,2.385; 8 -4.27,2.385 | smd 1.2 x 3.79: CASE1 -5.42,-0.695 | smd 1.45 x 1.4: CASE2 5.055,0.06 | smd 1 x 0.6: SW1 5.28,-1.19 | smd 0.95 x 0.85: SW2 4.355,-2.165
0402-RES = smd 0.7 x 0.9: 1 -0.65,0; 2 0.65,0
0805 = smd 0.8 x 1.2: 1 -0.9,0; 2 0.9,0
SONDER_H_VIBSCHALTER = smd 1.2 x 2.45: 1 -1.1,0; 2 1.1,0
DFN1411-3 = smd 1.25 x 0.75: D -0.4,0 | smd 0.6 x 0.4: G 0.675,-0.275; S 0.675,0.275
SFV5R = smd 0.3 x 1.4: P$1 0.5,0; P$2 1,0; P$3 1.5,0; P$4 2,0; P$5 2.5,0 | smd 2.3 x 2: P$6 -1.45,-1.45; P$7 4.45,-1.45
PRQC = smd 0.3 x 1.6: 1 -0.95,0; 2 0.95,0; GND 0,0
VNCL4000 = smd 0.35 x 1.05: 1 -1.5,-1.8; 2 -0.75,-1.8; 3 0,-1.8; 4 0.75,-1.8; 5 1.5,-1.8; 7 1.5,1.8; 8 0.75,1.8; 9 0,1.8; 10 -0.75,1.8; 11 -1.5,1.8 | smd 0.805 x 0.4: 6 1.75,-0.75; 12 -1.75,-0.2
USB-MICROB = smd 0.4 x 2: D+ 0,3.1; D- -0.65,3.1; GND 1.3,3.1; ID 0.65,3.1; VBUS -1.3,3.1 | smd 1.8 x 1.9: GND@2 -4,0.15; GND@3 4,0.15

### Placement (x,y rotation side)
BTN_PWR  55.55,11.4 90 top
C1  42.2,15.15 270 bottom
C2  21.5,5.25 0 bottom
C3  24.6,14.1 90 bottom
C4  30.4,4.6 180 bottom
C5  22.35,14.1 90 bottom
C6  15.95,14.4 90 bottom
C7  36.35,2.1 180 bottom
C8  27.85,12 0 bottom
C9  29.7,10.65 180 bottom
C10  50.15,8.55 0 bottom
C11  24.65,12 180 bottom
C12  41.1,13.5 270 bottom
C13  21.5,3.7 180 bottom
C14  40.85,4.85 270 bottom
C15  16.4,5.25 90 bottom
C16  18.5,5.25 180 bottom
C17  47.3,12.15 0 bottom
C18  33.08,11.85 180 bottom
C19  50.9,14.7 0 bottom
C20  54.05,15.68 270 bottom
C21  50.9,16.2 0 bottom
C22  34.1,14 0 bottom
IC1  25.9,8.9 90 top
IC2  36.2,7.2 90 bottom
IC3  51.8,11.25 0 bottom
IC4  19.6,9 0 bottom
IC5  25.77,9 0 bottom
IC6  19.1,14.4 270 bottom
JP1  29.3,2.4 180 bottom
L1  47.45,10.65 180 bottom
LED1  43.7,7.75 90 bottom
LED2  42.27,9.75 270 bottom
LED3  17.85,2.55 45 bottom
LED4  33.05,15.43 180 bottom
LED5  53.58,2.05 315 bottom
MICRO_SD1  42.5,6 90 top
R1  23.48,14.1 270 bottom
R2  47.25,13.65 0 bottom
R3  45.05,8.35 270 bottom
R4  47.45,3.05 90 bottom
R5  48.5,3.05 90 bottom
R6  31.1,2.6 270 bottom
R7  50.15,7.5 180 bottom
R8  52.1,6.9 270 bottom
R9  50.7,4.35 90 bottom
R10  49.55,4.35 270 bottom
R11  25.7,1.8 180 bottom
R12  42.27,11.7 270 bottom
R13  43.55,13.65 90 bottom
R14  27.98,14.1 270 bottom
R15  52.52,2.92 315 bottom
R16  21.5,1.8 0 bottom
R17  30.2,15.22 180 bottom
R18  26.85,14.1 90 bottom
R19  25.73,14.1 90 bottom
SW1  40.7,15.75 270 top
T1  30.23,13.05 90 bottom
U$1  48.75,15.15 180 top
U$6  30.35,7.05 90 bottom
U$9  25.2,4.45 0 bottom
VCNL4000  38,14.85 90 bottom
X1  54.27,5.4 90 top

### Tracks (layer width: path | path; a pad name or v marks a point on that pad's centre or on a via)
3G_INT2  (via drill 0.25)
  Top 0.15: 29.62,10.35 29.62,10.43 31.2,12 34.2,12 v34.58,12.4 | 29.62,10.35 29.62,7.53 29,6.9 26.95,6.9 v26.15,6.1 | IC1.34 25.47,16.98 25.8,16.65 26.73,16.65 27.05,16.35 27.05,13.28 28.95,11.32 29.62,10.65 29.62,10.35
  Bottom 0.15: IC5.6 26.1,7.1 26.15,7.05 v26.15,6.1 | v34.58,12.4 34.67,12.3 35.85,12.3 36.7,11.45 IC2.29
!RES_JEN  (via drill 0.25)
  Top 0.15: v30.2,16.1 30.8,16.1 31.65,16.95 31.82,17.12 IC1.29
  Bottom 0.15: IC2.32 38.2,11.35 37.65,11.9 37.23,11.9 36.2,12.93 35.52,12.93 35.17,13.28 32.25,13.28 31.65,13.88 31.65,14.25 31.35,14.55 30.3,14.55 30.2,14.65 v30.2,16.1
BALLSW  (via drill 0.25)
  Top 0.15: v43.55,13.65 43.5,13.65 42.9,13.05 41.9,13.05 41.42,13.53 | 41.42,13.53 40.7,14.25 40.65,14.25 SW1.2 | 41.42,13.53 41.4,13.5 41.4,11.7 41.1,11.4 39.98,11.4 38.77,12.6 37.95,12.6 36.78,11.43 IC1.23
  Bottom 0.15: R13.1 v43.55,13.65
BUCK_FB
  pour Bottom (no thermals): 51.65,10.12 51.65,9.3 51.35,9 50.3,9 50.3,6.9 52.55,6.9 52.55,7.8 51.95,8.4 51.95,10.12
BUCK_ON  (via drill 0.25)
  Top 0.15: v46.45,5.55 47.55,6.65 v47.55,6.75
  Bottom 0.15: IC3.7 52.25,9.7 52.25,8.55 52.85,7.95 52.85,5.78 52.73,5.62 50.17,5.62 49.7,5.15 R10.1 49.55,5.05 48.9,5.7 47.85,6.75 v47.55,6.75 | IC2.40 41.23,6.7 42.52,5.4 43.42,5.4 43.95,5.92 46.08,5.92 46.15,5.85 v46.45,5.55
CLK  (via drill 0.25)
  Top 0.15: MICRO_SD1.5 40.4,4.95 41.15,4.95 43.15,4.95 v43.95,4.15 | v34.85,2.55 34.7,2.7 34.1,2.7 33.35,1.95 23.75,1.95 22.93,1.13 IC1.6
  Bottom 0.15: v43.95,4.15 43.95,2.7 43.98,2.67 43.98,2.05 43.7,1.8 42.2,1.8 42.08,1.8 41.62,2.25 39.6,2.25 39.38,2.02 38.08,2.02 37.4,1.35 35.3,1.35 34.85,1.8 v34.85,2.55 34.7,2.7 IC2.9
CTS_JEN  (via drill 0.25)
  Top 0.15: IC1.16 36.31,2.54 35.4,3.45 33.3,3.45 v32.85,3.9
  Bottom 0.15: v32.85,3.9 32.85,4.55 IC2.12
GND  (via drill 0.25, 0.4)
  Top 0.3: v15.95,16.05 15.95,16.02 16.5,16.57 21.75,16.57 22.27,16.05 v22.25,16.05
  Top 0.305: U$1.P$4 U$1.P$5
  Bottom 0.15: IC6.3 19.73,16.38 19.85,16.5 21.8,16.5 v22.25,16.05 | 22.25,14.9 C5.2 | 23.3,14.1 23.45,13.95 R1.2
  Bottom 0.3: C6.2 v15.95,16.05 | v22.25,16.05 22.25,14.9 | C5.2 22.4,14.25 22.55,14.1 23.3,14.1
  other vias: 53.9,7.95 53.9,6.45 54.95,16.73 51.35,10.72 51.35,11.78 49.62,12.8 49.55,14.93 54.95,15.82 48.8,6.67 45.65,9.82 44.83,11.4 44.83,13.35 44.83,14.85 46.4,16.73 48.35,16.73 46.7,8.78 47.75,7.72 49.7,6 35.27,5.05 34.1,5.1 34.02,8.85 38.41,6.67 27.2,2.8 42.27,13.65 32.21,14.1 35.3,9.5 29.38,12.47 41.9,4.35 23.7,5.4 18.45,4.2 27.75,5.4 15.75,3.45 19.5,2.85 32.9,10.88 38.4,14.37 40.7,10.7 35.08,8.03 28.75,4.1 15.75,8.7 23.7,3.45 30.4,5.45
  pour Bottom (rank 3, no thermals): 44.45,10.65 44.45,17.4 55.55,17.4 55.55,5.7 49.4,5.7
  pour Top (rank 3, no thermals): 44.45,10.65 44.45,17.4 55.55,17.4 55.55,5.7 49.4,5.7
  pour Top (rank 4, no thermals): 15.5,0 15.5,18.15 55.7,18.15 55.7,0
  pour Bottom (rank 4, no thermals): 15.5,0 15.5,18.15 55.7,18.15 55.7,0
LEDRED  (via drill 0.25)
  Top 0.15: v40.85,11.97 40.85,12.6 40.25,13.2 40,13.2 39.25,13.95 39.25,14.65 37.7,16.2 37.65,16.2 32.5,16.2 29.8,13.5 29.8,13.38 29.55,13.12 28.65,13.12 28.35,13.43 28.35,16.05 28.01,16.39 IC1.32
  Bottom 0.15: LED2.P$2 41.85,7.7 41.3,8.25 41.3,11.53 v40.85,11.97
MISO  (via drill 0.25)
  Top 0.15: MICRO_SD1.7 40.13,2.85 40.25,3 41.55,3 42.15,3 44.12,3 v44.85,2.27 | v38.4,1.1 36.3,1.1 35.45,1.95 35.45,2.85 35.15,3.15 33.65,3.15 v33.2,2.7 32.75,2.25 25.48,2.25 v24.95,2.77
  Bottom 0.15: v44.85,2.27 44.85,1.9 44.15,1.2 42.1,1.2 41.77,1.2 41.33,1.65 39.9,1.65 39.38,1.12 38.42,1.12 v38.4,1.1 | IC2.11 33.75,3.25 v33.2,2.7 | R11.1 24.95,1.95 | 24.95,1.95 v24.95,2.77 | 24.95,1.95 24.2,1.2 IC1.7
MOSI  (via drill 0.25)
  Top 0.15: MICRO_SD1.3 43.22,7.23 44.5,5.9 v44.5,4.75 | v34.25,1.95 33.95,1.65 26,1.65 25.47,1.12 IC1.8
  Bottom 0.15: IC2.10 34.2,3.2 34.25,3.15 v34.25,1.95 35.15,1.05 37.55,1.05 38.23,1.73 39.52,1.73 39.75,1.95 41.48,1.95 41.92,1.5 42.05,1.5 43.85,1.5 44.27,1.9 44.27,2.58 44.5,2.8 v44.5,4.75
N$1  (via drill 0.25)
  Top 0.15: v43.4,2.42 43.45,2.35 44.08,1.73 47.27,1.73 v47.45,1.55
  Bottom 0.15: IC2.3 37.7,3.08 38.15,2.62 39.05,2.62 39.42,3 42.88,3 v43.4,2.42 | R4.1 v47.45,1.55
N$2
  Bottom 0.3: C16.1 15.65,5.25 15.65,7.05 16.5,7.9 IC4.16
N$3  (via drill 0.25)
  Top 0.15: v42.58,2.4 43.55,1.43 46.77,1.43 47.2,1 47.95,1 v48.5,1.55
  Bottom 0.15: IC2.4 37.2,3.05 37.92,2.33 39.2,2.33 39.42,2.55 42.45,2.55 v42.58,2.4 | v48.5,1.55 R5.1
N$4
  Bottom 0.3: IC2.6 36.2,2.65 C7.1
N$5
  Bottom 0.15: IC3.16 51,12.95 50.6,13.35 50.4,13.35 48.2,13.35 R2.1
N$6
  Bottom 0.3: VCNL4000.3 VCNL4000.2
N$8
  Bottom 0.3: C16.2 19,5.55 19,6.45 IC4.12
N$9  (via drill 0.25)
  Top 0.15: BTN_PWR.3 52.55,10.7 52.55,8.1 53.15,7.5 53.17,3.83 50.33,0.97 49.42,0.97 49.12,1.27 49.12,1.77 49.6,2.25 v50.1,2.25
  Bottom 0.15: IC3.4 53.27,10.88 53.75,10.88 54.5,10.12 54.5,6.15 53.3,4.95 52.35,4.95 51.45,4.05 51.45,3.3 50.45,2.25 v50.1,2.25
N$10
  Bottom 0.15: 18.5,15.62 IC6.2 18.5,15.62 | C6.1 16.7,14.55 16.7,16.35 16.85,16.5 18.35,16.5 18.5,16.35 18.5,15.62
N$11
  Bottom 0.15: LED1.P$2 43.75,10 R3.1
N$12  (via drill 0.25)
  Top 0.15: v45.95,8.35 45.95,9.15 46.4,9.6 47.15,9.6 49.25,11.7 v49.25,12
  Bottom 0.15: IC3.14 49.6,11.65 v49.25,12 | R3.2 45.3,7.7 v45.95,8.35
N$13
  Bottom 0.15: IC1.13 31.82,0.93 31.4,1.35 27.2,1.35 26.74,0.89 IC1.9
N$14
  Bottom 0.15: R6.2 31.2,2 31.55,1.65 32.6,1.65 33.09,1.16 IC1.14
N$16
  Bottom 0.15: IC2.17 31.7,7.2 30.95,7.95 30.85,7.95 U$6.2
N$17
  Bottom 0.15: IC2.16 31.65,6.7 31.1,6.15 30.4,6.15 U$6.1
N$25
  Bottom 0.3: C15.2 16.4,7.05 16.7,7.35 IC4.15
N$26
  Bottom 0.3: C3.1 24.5,13.2 25.3,12.4 C11.2 25.4,11.85 25.45,11.8 IC5.14
N$27
  Bottom 0.3: C3.2 R1.1
N$29
  Bottom 0.15: LED2.P$1 R12.2
N$30  (via drill 0.25)
  Top 0.15: v45.6,4.75 45.6,6.2 43.35,8.45 42.23,8.45 41.77,8.9 36.83,8.9 36.62,8.65 IC1.21
  Bottom 0.15: LED5.2 52.6,1.65 52.55,1.65 51.42,0.53 47.67,0.53 46.05,2.15 46.05,3.6 45.6,4.05 v45.6,4.75
N$31  (via drill 0.25)
  Top 0.15: v16.25,1.8 23.15,1.8 24.8,3.45 26.3,3.45 27.15,3.45 v27.8,4.1 | IC1.20 36.45,7.5 36.41,7.46 34.59,7.46 32.3,9.75 32.3,10.2 31.9,10.6 31.2,10.6 30.52,9.93 30.52,9.82 30.52,7.67 30.52,6.83 v29.23,5.53
  Bottom 0.15: LED3.2 16.25,2.36 v16.25,1.8 | v29.23,5.53 v27.8,4.1
N$32
  Bottom 0.3: R16.2 18.65,1.8 LED3.1
N$33
  Bottom 0.15: LED5.1 53.93,2.77 53.25,3.45 R15.1
N$34  (via drill 0.25)
  Top 0.15: v35.2,15.05 35.6,14.65 35.6,10.35 35.88,10.07 IC1.22
  Bottom 0.15: LED4.2 34.2,15.05
  Bottom 0.3: 34.2,15.05 v35.2,15.05
N$35
  Bottom 0.3: LED4.1 32.25,15.3 30.93,15.3 R17.2
PBSTAT  (via drill 0.25)
  Top 0.15: v49.7,1.55 50.2,1.55 51.25,2.6 51.25,3.2 50.85,3.6 46.73,3.6 46.5,3.6 45.75,3.6 v45.17,3.02 | v35.05,11.75 34.95,11.7 31.35,11.7 29.93,10.28 29.93,7.58 29.93,7.12 29.4,6.6 29.18,6.38 28.73,6.38 28.35,6 28.35,5.1 28.8,4.65 29.25,4.65 30.75,3.15 v32.4,3.15
  Bottom 0.15: IC3.3 54.05,11.25 54.8,10.5 54.8,6 53.45,4.65 52.5,4.65 51.75,3.9 51.75,3.15 50.2,1.55 v49.7,1.55 | v49.7,1.55 49.75,1.57 v49.7,1.55 | v45.17,3.02 45.45,2.75 45.45,1.95 44.4,0.9 41.6,0.9 41.15,1.35 40.05,1.35 39.23,0.53 34.88,0.53 34.42,0.53 | 34.42,0.53 32.4,2.55 v32.4,3.15 | 34.42,0.53 34.42,0.07 IC1.15 | IC2.28 36.15,10.75 36.15,11.55 35.95,11.75 v35.05,11.75
RTS_JEN  (via drill 0.25)
  Top 0.15: v31.62,11.15 31.25,11.15 30.23,10.12 30.23,7.88 30.23,6.97 29.32,6.08 28.88,6.08 28.65,5.85 28.65,5.25 28.95,4.95 29.4,4.95 29.85,4.5 33.15,4.5 33.84,3.81 IC1.17
  Bottom 0.15: IC2.22 32.7,10.07 v31.62,11.15
RX_JEN  (via drill 0.25)
  Top 0.15: IC1.19 37.11,6.15 35.45,6.15 31.65,9.95 31.6,10 v31.6,10.05
  Bottom 0.15: v31.6,10.05 31.6,9.7 32.1,9.2 IC2.21
SCLK  (via drill 0.25)
  Top 0.15: v28.7,9.68 28.7,11.1 26.48,13.32 v26.48,16.05 | v28.7,16.5 28.85,16.65 30,16.65 30.55,17.2 IC1.30 | v24.8,16.5 24.8,15.75 21.5,12.45 16.18,12.45 15.82,12.1 15.82,10.95 15.82,10.72 v16.1,10.45
  Bottom 0.15: IC2.18 32.17,7.7 31.48,8.4 28.8,8.4 28.5,8.7 28.5,9 28.25,9.25 | 28.25,9.25 28.43,9.25 28.62,9.45 v28.7,9.68 | VCNL4000.5 35.9,16.65 31.25,16.65 30.55,17.35 IC1.30 | v28.7,16.5 28.55,16.65 26.48,16.65 | IC4.24 19,12.1 18.8,12.3 18.12,12.3 IC6.8 17.23,12.6 17.07,12.45 16.18,12.45 15.82,12.1 15.82,10.72 v16.1,10.45 16.45,10.1 IC4.20 | 26.48,16.65 24.9,16.65 24.8,16.55 v24.8,16.5 24.8,16 25.35,15.45 25.73,15.07 R19.2 | v26.48,16.05 26.48,16.65 | 28.25,9.25 28.18,9.32 IC5.2
SDAT  (via drill 0.25)
  Top 0.15: v22.18,12.3 24.95,12.3 25.05,12.3 26.05,13.3 | 26.05,13.3 27.8,11.55 28.05,11.3 28.05,9.45 28.55,8.95 v29.05,8.95 29.05,7.85 v28.7,7.5 | v25.65,15.97 26.05,15.57 26.05,13.3
  Bottom 0.15: IC5.3 27.88,8.55 27.95,8.55 | 27.95,8.55 28.2,8.55 | IC2.19 32.2,8.2 31.55,8.85 30.5,8.85 29.2,8.85 v29.05,8.95 | 28.93,15.93 29.25,16.25 | VCNL4000.4 35.75,15.6 35,16.35 31.1,16.35 30.8,16.65 29.55,16.65 29.28,16.92 29.28,17.4 | IC4.25 19.55,12.15 | 19.55,12.15 IC6.7 17.57,14.1 16.85,14.1 16.7,13.95 16.7,12.9 16.55,12.75 15.97,12.75 15.53,12.3 15.53,11.93 15.53,10.03 16,9.55 IC4.19 | 19.55,12.15 19.4,12.3 v22.18,12.3 | v28.7,7.5 28.7,8.05 28.2,8.55 | 28.2,8.55 27.95,8.55 | 28.93,15.93 29.25,16.25 | 29.28,17.4 29.28,16.67 29.28,16.28 29.25,16.25 | 29.28,17.4 IC1.31 | v25.65,15.97 26.85,14.78 R18.2 26.85,14.7 27.05,14.9 27.05,16.1 27.3,16.35 28.05,16.35 28.48,15.93 28.93,15.93
SHWO
  Bottom 0.15: IC2.13 32.6,5.17 32.08,5.17 31.85,4.95 31.85,2.75 31.65,2.55 29.75,2.55 JP1.2
SSEL  (via drill 0.25)
  Top 0.15: MICRO_SD1.2 41.2,8.35 41.45,8.11 43.17,8.11 45.05,6.22 v45.05,4.15 | v40.45,0.8 40.17,0.53 35.67,0.53 34.85,1.35 28.4,1.35 28.01,0.96 IC1.10
  Bottom 0.15: IC2.1 38.75,3.75 38.75,3.6 41.67,3.6 42.15,3.6 43.05,4.5 43.45,4.5 44.27,5.33 44.75,5.33 45.05,5.03 v45.05,4.15 45.75,3.45 45.75,1.75 44.6,0.6 40.65,0.6 v40.45,0.8
STBY  (via drill 0.25)
  Top 0.15: v50.42,3.05 50.23,2.85 46.8,2.85 v46.6,3.05
  Bottom 0.15: IC3.6 52.62,9.72 52.62,8.78 53.15,8.25 53.15,5.55 53.15,5.45 52.95,5.25 52.2,5.25 50.85,3.9 R9.1 | 50.6,3.6 R9.1 | v50.42,3.05 50.7,3.33 R9.1 | v46.6,3.05 46.6,4 47.02,4.42 47.02,5.92 46.73,6.22 43.8,6.22 43.27,5.7 42.65,5.7 41.15,7.2 IC2.39
SUSP  (via drill 0.25)
  Top 0.15: v46.45,4.7 46.55,4.7 48.25,6.4 48.25,7.25 50.75,9.75 50.75,12.3 51.75,13.3 52.25,13.3 52.75,13.8 v53.08,13.8
  Bottom 0.15: IC3.19 52.2,13.3 52.7,13.8 v53.08,13.8 | IC2.41 41.3,6.2 42.4,5.1 43.6,5.1 44.12,5.62 45.58,5.62 45.6,5.6 v46.45,4.7
SW
  pour Bottom (no thermals): 50.67,11.1 49.7,11.1 48.65,10.05 47.75,10.05 47.75,11.4 50.67,11.4
TX_JEN  (via drill 0.25)
  Top 0.15: IC1.18 37.04,4.95 36.2,4.95 31.75,9.4 v31.1,9.4
  Bottom 0.15: v31.1,9.4 31.45,9.4 32.15,8.7 IC2.20
USB_D+  (via drill 0.25)
  Top 0.15: v48.27,5.08 48.6,5.4 X1.D+
  Bottom 0.15: R5.2 48.65,3.45 48.27,3.83 v48.27,5.08
USB_D-  (via drill 0.25)
  Top 0.15: X1.D- 50.38,4.8 48.85,4.8 48.55,4.5 47.65,4.5 v47.6,4.55
  Bottom 0.15: R4.2 47.45,4.4 v47.6,4.55
VBUS  (via drill 0.25, 0.5)
  Top 0.15: X1.VBUS 50.45,4.1 50.33,3.98 50.25,3.98 45.67,3.98 45.3,3.6 v43.1,3.6
  Top 0.4: X1.VBUS 52.45,4.1 52.7,4.35 52.7,7.2 52.1,7.8 52.1,12.05 52.3,12.25 53.85,12.25 54.8,13.2 v54.8,13.65
  Bottom 0.15: IC2.7 35.75,3.75 35.75,4.35 35.6,4.5 35,4.5 34.7,4.8 34.7,5.4 35,5.7 36.8,5.7 38.15,4.35 38.15,3.75 IC2.2 38.15,3.65 38.15,3.08 38.3,2.92 38.92,2.92 39.3,3.3 42.83,3.3 43.08,3.55 v43.1,3.6
  Bottom 0.4: v54.8,13.65 54.8,14.25 54.38,14.82 C20.2
  pour Bottom (no thermals): 52.55,12.38 52.55,13.2 53.6,14.25 53.6,15.3 54.65,15.3 55.25,14.7 55.25,13.2 55.1,13.05 54.2,13.05 53.45,12.38
VCC  (via drill 0.4, 0.5)
  Top 0.3: MICRO_SD1.4 42.76,6.13 v43,6.38 | 36.36,12.46 IC1.24 | v27.68,15.68 27.68,13.2 29.1,11.78 30.38,11.78 31.35,12.75 v31.35,12.82
  Top 0.4: 36.39,12.45 IC1.24 36.99,13.05 39.35,13.05 v39.95,12.45
  Bottom 0.15: 53.65,12.05 54.2,12.45 54.25,12.5 | IC3.1 53.65,12.05 | 53.65,12.05 54.2,12.6 54.88,12.6 55.17,12.3 55.17,10.5 55.1,10.43 55.1,5.78 53.7,4.35 52.65,4.35 52.05,3.75 52.05,2.7 50.33,0.97 49.42,0.97 49.12,1.27 49.12,1.77 49.5,2.15 49.55,2.2 R10.2 49.55,3.95 49.4,3.95 49,4.35 | 31.18,4.42 31.15,4.45 C4.2 | R9.2 50.7,4.65 50.55,4.5 50.4,4.35 49.95,4.35 49,4.35 | 49,4.35 48.85,4.5 48.85,5.3 48.2,5.95 47.45,5.95 46.67,6.72
  Bottom 0.2: IC2.34 39.75,9.75
  Bottom 0.3: C4.2 31,4.65 32.05,5.7 IC2.14 32.75,5.7 33.8,5.7 34.25,6.15 34.25,8.1 35,8.85 | C14.2 40.35,4.7 IC2.44 39,4.7 37.77,5.92 37.77,8.85 | 39.75,9.75 39.75,10 39.75,12.2 v39.95,12.45 | IC2.34 39.08,9.7 37.77,8.85 | 40.95,12.9 C12.2 | 26.9,3.45 26.35,2.9 R11.2 | 35,8.85 37.7,8.85 37.77,8.85 | 26.9,3.45 28.55,3.45 30.7,3.45 R6.1 31.18,3.58 31.18,4.42 | 47.9,8.85 46.85,7.8 46.85,6.9 46.67,6.72 46.55,6.6 43.23,6.6 v43,6.38 | 35,8.85 34.85,8.95 34.2,9.6 IC2.24 34.2,11.35 33.8,11.85 C18.2 33.73,12.32 33.45,12.6 31.95,12.6 31.75,12.6 31.57,12.6 v31.35,12.82 31.35,13.05 30.68,13.72 T1.S | 52.05,2.7 52.21,2.7 R15.2 | R14.1 27.9,14.68 27.9,14.4 27.6,14.1 27.15,14.1 26.85,13.8 R18.1 R19.1 | R16.1 23.05,1.8 24.7,3.45 26.9,3.45 | R17.1 29.35,14.95 28.32,14.95 28,14.93 R14.1 | v27.68,15.68 27.68,15.07 R14.1
  Bottom 0.4: v39.95,12.45 40.45,12.8 C12.2 41.6,12.35 R12.1 42.6,11.95 42.95,11.95 44.35,11.95 44.55,12.15 44.7,12.15 46.4,12.15 46.45,12.1 C17.2
  pour Bottom (no thermals): 47.3,12.6 47.3,10.2 48.5,9 50,9 50,6.9 49.4,6.9 45.8,10.5 45.8,12.6
VOUT  (via drill 0.4, 0.5)
  Top 0.3: v49.55,9.75 48.8,9.75 46.4,7.35 v46.1,7.35 45.8,7.35 44.3,8.85 42.7,8.85 41.5,10.05 39.35,10.05 38.52,10.88 v38.52,11.93
  Top 0.305: U$1.P$2 U$1.P$1
  Top 0.4: v49.55,9.75 49.7,9.75 50.3,10.35 50.3,12.6 51.45,13.75 | 51.45,13.75 52.05,13.75 52.85,14.55 v52.92,14.78 | U$1.P$1 48.25,14.15 48.6,13.75 51.45,13.75
  Bottom 0.3: v46.1,7.35 45.8,7.05 43.85,7.05 43.6,7.3 LED1.P$1 | C22.1 35.65,13.35 VCNL4000.1 36.48,13.35 37.52,12.3 38.08,12.3 v38.52,11.93
  Bottom 0.4: IC3.11 50.25,10.45
  pour Bottom (no thermals): 51.65,12.38 51.65,13.65 51.05,14.25 51.05,16.5 51.2,16.65 53,16.65 53.3,16.35 53.3,14.55 52.25,13.5 52.25,12.75 51.88,12.38
  pour Bottom (rank 2, no thermals): 50.6,10.95 49.7,10.95 48.95,10.2 48.95,9.45 49.1,9.3 50,9.3 50.75,10.05 50.75,10.8
VSENS  (via drill 0.4)
  Top 0.3: v23.1,11.25 25.5,11.25 v26.25,12 | v23.1,11.25 23.1,6.45 v22.95,6.3 | v16.5,11.7 16.8,12 21.45,12 22.2,11.25 v23.1,11.25 | v38.7,16.57 32.23,16.57 29.4,13.75 v29.07,13.75
  Bottom 0.3: IC4.6 IC4.7 22.05,7.35 22.05,5.3 C2.1 | C2.1 22.15,3.5 C13.2 | IC4.23 IC4.22 17.82,11.7 v16.5,11.7 | IC5.5 26.75,9.65 27.05,9.95 IC5.1 | IC6.1 17.23,15.22 18.2,14.25 20.6,14.25 20.98,14.62 | 20.98,14.62 IC6.5 22.2,13.2 22.35,13.05 | IC6.4 20.98,14.62 | v23.1,11.25 23.1,12.3 22.35,13.05 | 22.35,13.05 C5.1 | C8.2 27.25,12.25 27.75,12.75 28.45,12.75 28.57,12.75 28.95,13.12 29.75,13.12 | v22.95,6.3 22.15,5.5 C2.1 | v38.7,16.57 38.92,16.35 VCNL4000.7 41.6,16.35 42.15,15.8 C1.1 43,15.8 43.5,15.3 43.5,14.6 R13.2 | v29.07,13.75 29.1,13.72 29.1,13.5 29.48,13.12 29.75,13.12 | 29.75,13.12 29.84,13.04 | 29.84,13.04 T1.D | 29.75,13.12 29.84,13.04
  pour Bottom (no thermals): 27.6,12.45 25.8,12.45 25.8,10.2 26.55,10.2 27,9.75 28.95,9.75 29.4,10.2 29.4,11.1 28.05,11.1 27.6,11.55
VSENS_OFF
  Bottom 0.15: IC2.31 37.7,11.35 37.5,11.55 37.05,11.55 35.98,12.62 35.38,12.62 35.02,12.97 32.1,12.97 31.95,13.12 31.35,13.72 31.35,14.1 31.2,14.25 30.75,14.25 30.35,14.25 30.07,14.25 | R14.2 28.07,13.35 28.07,13.68 28.8,14.4 29.5,14.4 29.93,14.4 30.07,14.25 | T1.G 29.95,14.12 30.07,14.25

### Text on the board
tPlace: jNode v3.1 | + | -